# EAGLE design EcuaBoard (EAGLE 6.5.0)
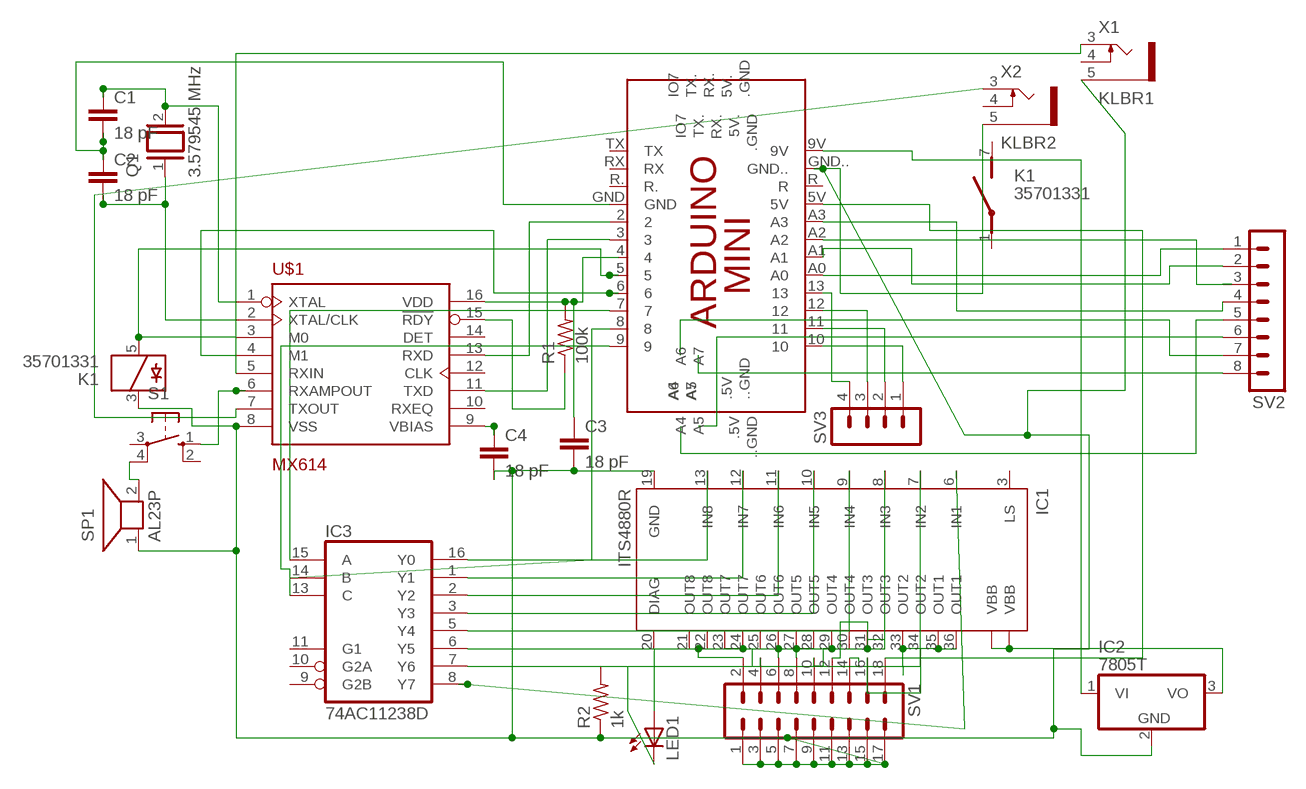
[diagram p0: schematic, sheet 1]

## Parts
C1  18 pF  C2.5/2  [C2.5-2]
C2  18 pF  C2.5/2  [C2.5-2]
C3  18 pF  C2.5/2  [C2.5-2]
C4  18 pF  C2.5/2  [C2.5-2]
IC1  ITS4880R  [PG-DSO-36]
IC2  7805T  [TO220H]
IC3  74AC11238D  [SO16]
K1  35701331  [REED]
LED1  LED5MM  [LED5MM]
PCB1  ARDUINO_MINI  [ARDUINO_MINI]
Q1  3.579545 MHz  XTAL  [Q]
R1  100k  R-US_0207/10  [0207/10]
R2  1k  R-US_0207/10  [0207/10]
S1  10-XX  [B3F-10XX]
SP1  AL23P  [AL23P]
SV1  MA09-2  [MA09-2]
SV2  MA08-1  [MA08-1]
SV3  MA04-1  [MA04-1]
U$1  MX614  [SO16-1]
X1  KLBR1  [KLBR1]
X2  KLBR2  [KLBR2]

## Nets
N$1: IC1.21(OUT8) IC1.22(OUT8) SV1.2
N$2: PCB1.5V SV1.18
N$3: C3.1 PCB1.4 R1.2 U$1.16(VDD)
N$4: IC1.23(OUT7) IC1.24(OUT7) SV1.4
N$5: IC1.25(OUT6) IC1.26(OUT6) SV1.6
N$6: IC1.27(OUT5) IC1.28(OUT5) SV1.8
N$7: IC1.29(OUT4) IC1.30(OUT4) SV1.10
N$8: PCB1.2 U$1.13(RXD)
N$9: PCB1.3 U$1.11(TXD)
N$10: K1.5 PCB1.5 U$1.3(M0)
N$11: PCB1.6 U$1.4(M1)
N$12: C2.2 Q1.1 U$1.2(XTAL/CLK)
N$13: C1.1 Q1.2 U$1.1(XTAL)
N$14: IC1.31(OUT3) IC1.32(OUT3) SV1.12
N$15: C1.2 C2.1 PCB1.GND
N$16: R1.1 U$1.15(!RDY)
N$17: C4.1 U$1.9(VBIAS)
N$18: IC2.1(VI) PCB1.9V
N$19: S1.4(P1) SP1.2
N$20: S1.1(S) U$1.6(RXAMPOUT)
N$21: IC1.33(OUT2) IC1.34(OUT2) SV1.14
N$22: U$1.7(TXOUT) X2.3
N$23: U$1.5(RXIN) X1.3
N$24: IC1.35(OUT1) IC1.36(OUT1) SV1.16
N$25: IC1.TH@1(VBB) IC1.TH@2(VBB) IC2.3(VO)
N$26: IC1.20(DIAG) LED1.A
N$27: LED1.K(C) R2.2
N$28: IC3.15(A) PCB1.7
N$29: IC3.14(B) PCB1.8
N$30: IC3.13(C) PCB1.9
N$31: IC1.13(IN8) IC3.16(Y0)
N$32: IC1.12(IN7) IC3.1(Y1)
N$33: IC1.11(IN6) IC3.2(Y2)
N$34: IC1.10(IN5) IC3.3(Y3)
N$35: IC1.9(IN4) IC3.5(Y4)
N$36: IC1.8(IN3) IC3.6(Y5)
N$37: IC1.7(IN2) IC3.7(Y6)
N$38: IC1.6(IN1) IC3.8(Y7)
N$39: PCB1.A0 SV2.1
N$40: PCB1.A1 SV2.2
N$41: PCB1.A2
N$42: PCB1.A3 SV2.4
N$43: SV2.5
N$44: SV2.6
N$45: SV2.7
N$46: SV2.8
N$47: PCB1.10 SV3.1
N$48: PCB1.11 SV3.2
N$49: PCB1.12 SV3.3
N$50: PCB1.13 SV3.4
VSS: C3.2 C4.2 IC1.19(GND) IC2.2(GND) K1.3 PCB1.GND.. R2.1 SP1.1 SV1.1 SV1.3 SV1.5 SV1.7 SV1.9 SV1.11 SV1.13 SV1.15 SV1.17 U$1.8(VSS) X1.5 X2.5
Unconnected: IC1.3(LS) IC3.9(G2B) IC3.10(G2A) IC3.11(G1) K1.1(2:P) K1.7(2:S) PCB1.5V. PCB1..5V PCB1...GND PCB1..GND PCB1.A4 PCB1.A5 PCB1.A6 PCB1.A7 PCB1.IO7 PCB1.R PCB1.R. PCB1.RX PCB1.RX. PCB1.TX PCB1.TX. S1.2(S1) S1.3(P) SV2.3 U$1.10(RXEQ) U$1.12(CLK) U$1.14(DET) X1.4 X2.4

## Power pins joined to a net without a drawn wire
GND: IC3.4(GND)
VCC: IC3.12(VCC)

## Library data of the parts
C1-C4 = capacitor-wima:C: CAPACITOR naming: grid - package width
IC1 = infineon:ITS4880R: Smart Power High-Side-Switch for Industrial Applications. Eight Channels: 8 x 200 mOhm Source: http://www.infineon.com .. ITS4880R_20060309.pdf; MPN: ITS4880R; OC_FARNELL: 1440818; OC_NEWARK: 58M7534
IC2 = linear:78*: Positive VOLTAGE REGULATOR Source: http://cache.national.com/ds/LM/LM78L05.pdf http://www.fairchildsemi.com/ds/LM/LM7805.pdf
IC3 = 74ac-logic:74AC11238: 3 to 8 line DECODER/DEMULTIPLEXER
K1 = relay:35701331: RELAY reed, 1 x norm. open with polarity; OC_FARNELL: unknown; OC_NEWARK: unknown
LED1 = led:LED: LED OSRAM: - CHIPLED LG R971, LG N971, LY N971, LG Q971, LY Q971, LO R971, LY R971 LH N974, LH R974 LS Q976, LO Q976, LY Q976 LO Q996 - Hyper CHIPLED LW Q18S LB Q993, LB Q99A, LB R99A - SideLED LS A670, LO A670, LY A670, LG A670, LP A670 LB A673, LV A673, LT A673, LW A673 LH A674 LY A675 LS A676, LA A676, LO A676, LY A676, LW A676 LS A679, LY A679, LG A679 - Hyper Micro SIDELED® LS Y876, LA Y876, LO Y876, LY Y876 LT Y87S - SmartLED LW L88C, LW L88S LB L89C, LB L89S, LG L890 LS L89K, LO L89K, LY L89K LS L896, LA L896, LO L896, LY L896 - TOPLED LS T670, LO T670, LY T670, LG T670, LP T670 LSG T670, LSP T670, LSY T670, LOP T670, LYG T670 LG T671, LOG T671, LSG T671 LB T673, LV T673, LT T673, LW T673 LH T674 LS T676, LA T676, LO T676, LY T676, LB T676, LH T676, LSB T676, LW T676 LB T67C, LV T67C, LT T67C, LS T67K, LO T67K, LY T67K, LW E67C LS E67B, LA E67B, LO E67B, LY E67B, LB E67C, LV E67C, LT E67C LW T67C LS T679, LY T679, LG T679 LS T770, LO T770, LY T770, LG T770, LP T770 LB T773, LV T773, LT T773, LW T773 LH T774 LS E675, LA E675, LY E675, LS T675 LS T776, LA T776, LO T776, LY T776, LB T776 LHGB T686 LT T68C, LB T68C - Hyper Mini TOPLED® LB M676 - Mini TOPLED Santana® LG M470 LS M47K, LO M47K, LY M47K Source: http://www.osram.convergy.de LUXEON: - LUMILED® LXK2-PW12-R00, LXK2-PW12-S00, LXK2-PW14-U00, LXK2-PW14-V00 LXK2-PM12-R00, LXK2-PM12-S00, LXK2-PM14-U00 LXK2-PE12-Q00, LXK2-PE12-R00, LXK2-PE12-S00, LXK2-PE14-T00, LXK2-PE14-U00 LXK2-PB12-K00, LXK2-PB12-L00, LXK2-PB12-M00, LXK2-PB14-N00, LXK2-PB14-P00, LXK2-PB14-Q00 LXK2-PR12-L00, LXK2-PR12-M00, LXK2-PR14-Q00, LXK2-PR14-R00 LXK2-PD12-Q00, LXK2-PD12-R00, LXK2-PD12-S00 LXK2-PH12-R00, LXK2-PH12-S00 LXK2-PL12-P00, LXK2-PL12-Q00, LXK2-PL12-R00 Source: www.luxeon.com KINGBRIGHT: KA-3528ASYC Source: www.kingbright.com
PCB1 = E14_Arduino_published:ARDUINO_MINI: Device for representing an Arduino Mini board with a footprint in an EAGLE design. Created by Dave Young for Element14. More EAGLE documentation at: http://www.element14.com/community/community/knode/cadsoft_eagle
Q1 = special:XTAL: CRYSTAL
R1 R2 = rcl:R-US_: RESISTOR, American symbol
S1 = switch-omron:10-XX: OMRON SWITCH; MPN: B3F-1000; OC_FARNELL: 176432; OC_NEWARK: 36M3542
SP1 = buzzer:AL23P: SPEAKER Source: Buerklin; OC_FARNELL: unknown; OC_NEWARK: unknown
SV1 = con-lstb:MA09-2: PIN HEADER; OC_FARNELL: unknown; OC_NEWARK: unknown
SV2 = con-lstb:MA08-1: PIN HEADER; OC_FARNELL: unknown; OC_NEWARK: unknown
SV3 = con-lstb:MA04-1: PIN HEADER; OC_FARNELL: unknown; OC_NEWARK: unknown
U$1 = mx614:MX614
X1 = con-lumberg:KLBR?: Jack connectors according to JISC 6560, 2.5mm / 3.5 mm Klinkensteckverbinder nach JISC 6560, 2.5mm / 3,5 mm Source: http://www.lumberg.com/Produkte/PDFs/KLBR2.pdf www.lumberg.com/Produkte/PDFs/KLBR1.pdf; MPN: KLBR 1; OC_FARNELL: 1200140; OC_NEWARK: 97K2707
X2 = con-lumberg:KLBR?: Jack connectors according to JISC 6560, 2.5mm / 3.5 mm Klinkensteckverbinder nach JISC 6560, 2.5mm / 3,5 mm Source: http://www.lumberg.com/Produkte/PDFs/KLBR2.pdf www.lumberg.com/Produkte/PDFs/KLBR1.pdf; OC_FARNELL: unknown; OC_NEWARK: unknown

## Board
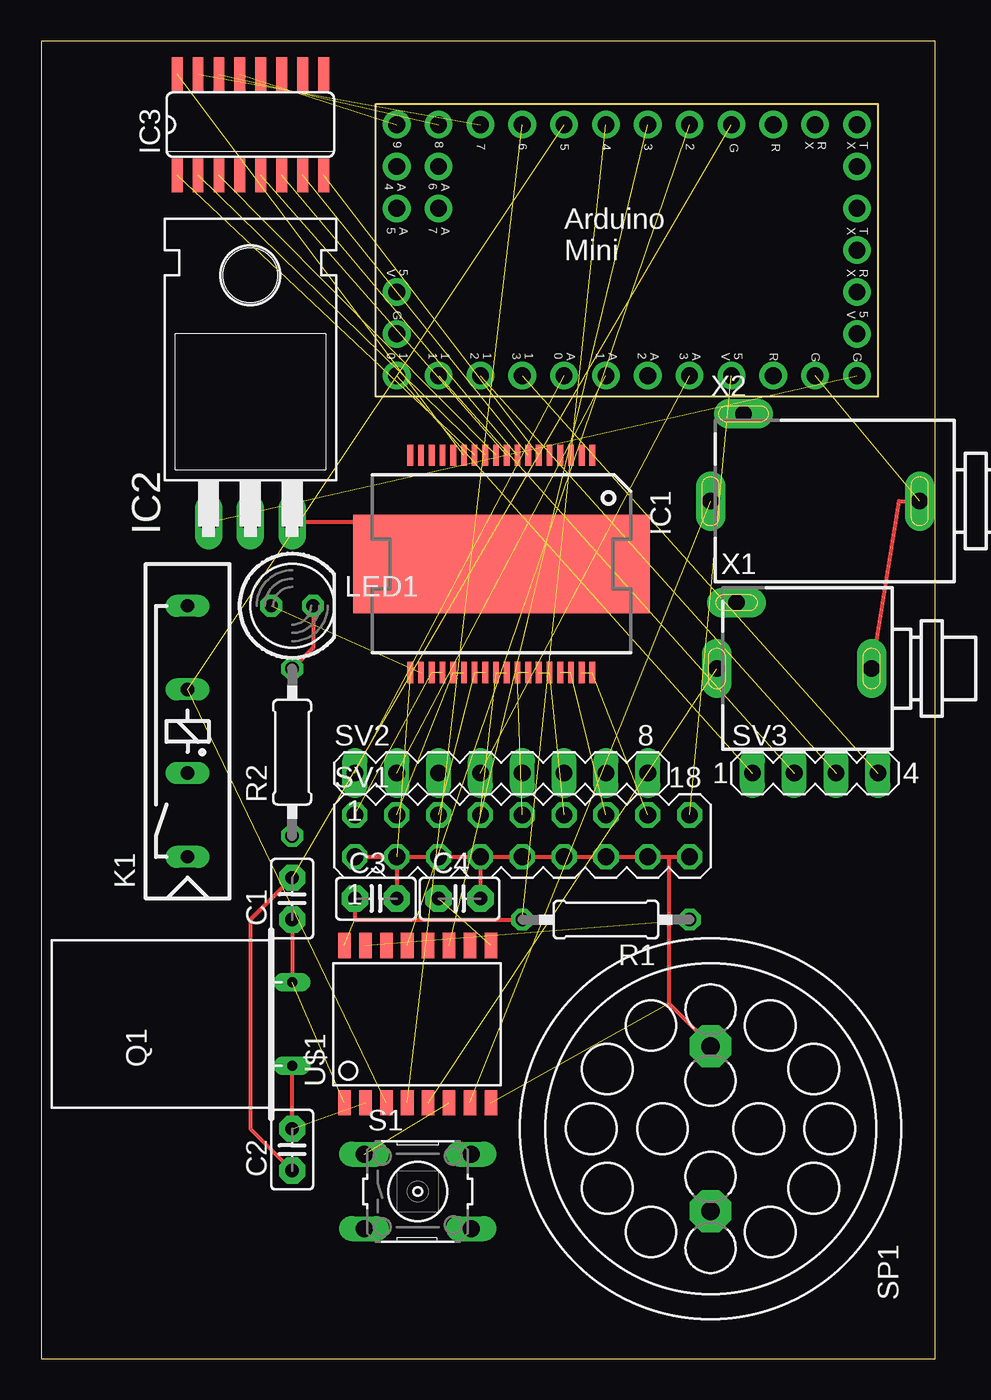
[diagram p1: board, top side]
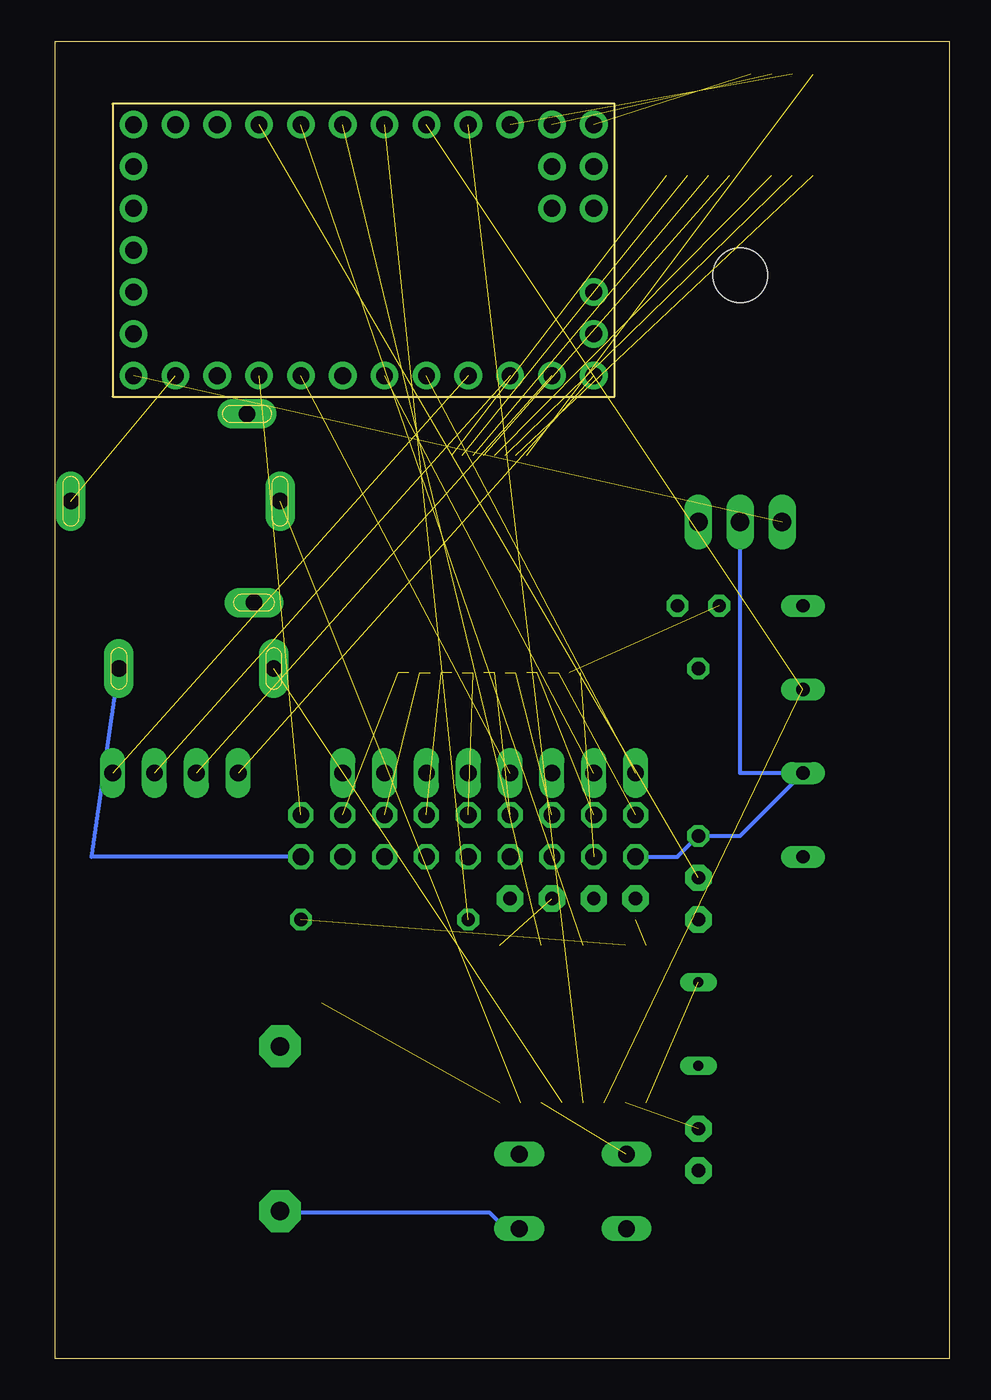
[diagram p2: board, bottom side, seen from below]

Size 54.28 x 80 mm. Coordinates in mm from the lower left corner, seen from the top.
Outline: 0,0 54.28,0 54.28,80 0,80 0,0
Copper layers (1*16): Top 0.035mm / dielectric 1.5mm / Bottom 0.035mm
Design rules "default": minimum track width 10mil, minimum drill 24mil, track to track 8mil, track to pad 8mil, pad to pad 8mil, via to via 8mil, smd to smd 8mil, copper to edge 40mil, drill to drill 8mil, minimum pad ring 10mil, minimum via ring 8mil, stop-mask expansion 4mil, vias tented up to drill 0mil, thermal gap 10mil

### Footprints (pad centres in the part's own frame; a part is rotated, then mirrored left to right if it is on the bottom)
C2.5-2 = drill 0.813 pad 1.6 octagon: 1 -1.27,0; 2 1.27,0
PG-DSO-36 = smd 0.35 x 1.3: 1 -5.525,-6.6; 2 -4.875,-6.6; 3 -4.225,-6.6; 4 -3.575,-6.6; 5 -2.925,-6.6; 6 -2.275,-6.6; 7 -1.625,-6.6; 8 -0.975,-6.6; 9 -0.325,-6.6; 10 0.325,-6.6; 11 0.975,-6.6; 12 1.625,-6.6; 13 2.275,-6.6; 14 2.925,-6.6; 15 3.575,-6.6; 16 4.225,-6.6; 17 4.875,-6.6; 18 5.525,-6.6; 19 5.525,6.6; 20 4.875,6.6; 21 4.225,6.6; 22 3.575,6.6; 23 2.925,6.6; 24 2.275,6.6; 25 1.625,6.6; 26 0.975,6.6; 27 0.325,6.6; 28 -0.325,6.6; 29 -0.975,6.6; 30 -1.625,6.6; 31 -2.275,6.6; 32 -2.925,6.6; 33 -3.575,6.6; 34 -4.225,6.6; 35 -4.875,6.6; 36 -5.525,6.6 | smd 9.5 x 6: TH@1 -4.25,0; TH@2 4.25,0
TO220H = drill 1.118 long: 1 -2.54,-10.16; 2 0,-10.16; 3 2.54,-10.16 | hole 3.302: 0,4.826
SO16 = smd 0.66 x 2.032: 1 -4.445,-3.073; 2 -3.175,-3.073; 3 -1.905,-3.073; 4 -0.635,-3.073; 5 0.635,-3.073; 6 1.905,-3.073; 7 3.175,-3.073; 8 4.445,-3.073; 9 4.445,3.073; 10 3.175,3.073; 11 1.905,3.073; 12 0.635,3.073; 13 -0.635,3.073; 14 -1.905,3.073; 15 -3.175,3.073; 16 -4.445,3.073
REED = drill 0.813 long: 1 -17.78,2.54; 3 -12.7,2.54; 5 -7.62,2.54; 7 -2.54,2.54
LED5MM = drill 0.813 octagon: A -1.27,0; K 1.27,0
ARDUINO_MINI = drill 1.016 pad 1.676: 2 19.05,16.51; 3 16.51,16.51; 4 13.97,16.51; 5 11.43,16.51; 5V 21.59,1.27; 5V. 29.21,6.35; 6 8.89,16.51; 7 6.35,16.51; 8 3.81,16.51; 9 1.27,16.51; 9V 29.21,1.27; 10 1.27,1.27; 11 3.81,1.27; 12 6.35,1.27; 13 8.89,1.27; .5V 1.27,6.35; ..GND 1.27,3.81; .GND 29.21,3.81; A0 11.43,1.27; A1 13.97,1.27; A2 16.51,1.27; A3 19.05,1.27; A4 1.27,13.97; A5 1.27,11.43; A6 3.81,13.97; A7 3.81,11.43; GND 21.59,16.51; GND.. 26.67,1.27; IO7 29.21,13.97; R 24.13,1.27; R. 24.13,16.51; RX 26.67,16.51; RX. 29.21,8.89; TX 29.21,16.51; TX. 29.21,11.43
Q = drill 0.61 long: 1 -2.54,-7.62; 2 2.54,-7.62
0207/10 = drill 0.813 octagon: 1 -5.08,0; 2 5.08,0
B3F-10XX = drill 1.016 long: 1 -3.251,2.261; 2 3.251,2.261; 3 -3.251,-2.261; 4 3.251,-2.261
AL23P = drill 1.118 pad 2.54 octagon: 1 -5.004,0; 2 5.004,0
MA09-2 = drill 1.016 octagon: 1 -10.16,-1.27; 2 -10.16,1.27; 3 -7.62,-1.27; 4 -7.62,1.27; 5 -5.08,-1.27; 6 -5.08,1.27; 7 -2.54,-1.27; 8 -2.54,1.27; 9 0,-1.27; 10 0,1.27; 11 2.54,-1.27; 12 2.54,1.27; 13 5.08,-1.27; 14 5.08,1.27; 15 7.62,-1.27; 16 7.62,1.27; 17 10.16,-1.27; 18 10.16,1.27
MA08-1 = drill 1.016 long: 1 -8.89,0; 2 -6.35,0; 3 -3.81,0; 4 -1.27,0; 5 1.27,0; 6 3.81,0; 7 6.35,0; 8 8.89,0
MA04-1 = drill 1.016 long: 1 -3.81,0; 2 -1.27,0; 3 1.27,0; 4 3.81,0
SO16-1 = smd 0.762 x 1.524: 1 -4.445,-4.775; 2 -3.175,-4.775; 3 -1.905,-4.775; 4 -0.635,-4.775; 5 0.635,-4.775; 6 1.905,-4.775; 7 3.175,-4.775; 8 4.445,-4.775; 9 4.445,4.775; 10 3.175,4.775; 11 1.905,4.775; 12 0.635,4.775; 13 -0.635,4.775; 14 -1.905,4.775; 15 -3.175,4.775; 16 -4.445,4.775
KLBR1 = drill 1 pad 1.8 long: 3 0,-4.7; 4 -4,-3.5; 5 0,4.7
KLBR2 = drill 1 pad 1.8 long: 3 0,-6.35; 4 -5.3,-4.35; 5 0,6.35

### Placement (x,y rotation side)
C1  15.24,27.94 90 top
C2  15.24,12.7 90 top
C3  20.32,27.94 0 top
C4  25.4,27.94 0 top
IC1  27.94,48.26 180 top
IC2  12.7,60.96 0 top
IC3  12.7,74.93 0 top
K1  11.43,48.26 90 top
LED1  15.24,45.72 0 top
PCB1  20.32,58.42 0 top
Q1  7.62,20.32 90 top
R1  34.29,26.67 180 top
R2  15.24,36.83 90 top
S1  22.86,10.16 0 top
SP1  40.64,13.97 270 top
SV1  29.21,31.75 0 top
SV2  27.94,35.56 0 top
SV3  46.99,35.56 0 top
U$1  22.86,20.32 0 top
X1  45.72,41.91 270 top
X2  46.99,52.07 270 top

### Tracks (layer width: path | path; a pad name or v marks a point on that pad's centre or on a via)
N$1  (2 unrouted)
N$2  (1 unrouted)
N$3  (2 unrouted)
  Top 0.254: R1.2 19.05,26.67 C3.1
N$4  (2 unrouted)
N$5  (2 unrouted)
N$6  (2 unrouted)
N$7  (2 unrouted)
N$8  (1 unrouted)
N$9  (1 unrouted)
N$10  (2 unrouted)
N$11  (1 unrouted)
N$12  (1 unrouted)
  Top 0.254: C2.2 Q1.1
N$13  (1 unrouted)
  Top 0.254: C1.1 Q1.2
N$14  (2 unrouted)
N$15  (1 unrouted)
  Top 0.254: C2.1 12.7,13.97 12.7,26.67 C1.2
N$16  (1 unrouted)
N$17  (1 unrouted)
N$18  (1 unrouted)
N$19
  Bottom 0.254: S1.4 26.67,7.62 27.94,8.89 40.64,8.89 SP1.2
N$20  (1 unrouted)
N$21  (2 unrouted)
N$22  (1 unrouted)
N$23  (1 unrouted)
N$24  (2 unrouted)
N$25
  Top 0.254: IC2.3 22.86,50.8 22.86,48.26 IC1.TH@2 IC1.TH@1
N$26  (1 unrouted)
N$27
  Top 0.254: R2.2 16.51,43.18 LED1.K
N$28  (1 unrouted)
N$29  (1 unrouted)
N$30  (1 unrouted)
N$31  (1 unrouted)
N$32  (1 unrouted)
N$33  (1 unrouted)
N$34  (1 unrouted)
N$35  (1 unrouted)
N$36  (1 unrouted)
N$37  (1 unrouted)
N$38  (1 unrouted)
N$39  (1 unrouted)
N$40  (1 unrouted)
N$42  (1 unrouted)
N$47  (1 unrouted)
N$48  (1 unrouted)
N$49  (1 unrouted)
N$50  (1 unrouted)
VSS  (3 unrouted)
  Top 0.254: X1.5 52.07,52.07 X2.5 | SV1.1 SV1.3 | SV1.3 SV1.5 SV1.7 | SV1.7 SV1.9 SV1.11 SV1.13 SV1.15 38.1,30.48 | 38.1,30.48 SV1.17 | SV1.3 C3.2 | SV1.7 C4.2 | 38.1,30.48 38.1,21.59 40.64,19.05 SP1.1
  Bottom 0.254: SV1.1 16.51,30.48 R2.1 12.7,31.75 K1.3 12.7,35.56 IC2.2 | X1.5 52.07,30.48 SV1.17